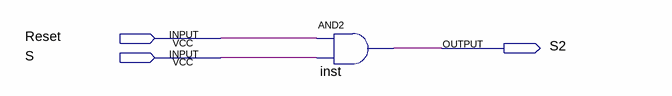
[diagram p0: schematic sheet]
// Quartus schematic moduloReset.bdf as structural Verilog: 1 symbols, 3 pins
module moduloReset (
  input  Reset,
  input  S,
  output S2
);

  and inst (S2, Reset, S);
endmodule
